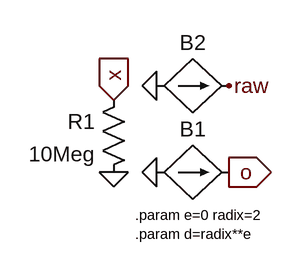
[diagram p0: schematic adc_bit_extract.asc]
adc_bit_extract.asc, the LTspice schematic file:
Version 4
SHEET 1 880 680
FLAG 256 208 o
IOPIN 256 208 Out
FLAG 176 208 0
FLAG 128 208 0
FLAG 128 128 x
IOPIN 128 128 In
FLAG 256 112 raw
FLAG 176 112 0
SYMBOL bi 176 208 R270
WINDOW 0 32 40 VTop 2
WINDOW 3 -32 65 Invisible 2
SYMATTR InstName B1
SYMATTR Value I=V(raw)-int(V(raw)/radix)*radix
SYMATTR Value2 Rpar=1
SYMBOL res 144 112 M0
SYMATTR InstName R1
SYMATTR Value 10Meg
SYMBOL bi 176 112 R270
WINDOW 0 32 40 VTop 2
WINDOW 3 -32 65 Invisible 2
SYMATTR InstName B2
SYMATTR Value I=int(V(x)/d)
SYMATTR Value2 Rpar=1
TEXT 152 256 Left 1 !.param e=0 radix=2\n.param d=radix**e

The netlist it stands for:
* adc_bit_extract.asc
B1 0 o I=V(raw)-int(V(raw)/radix)*radix Rpar=1
R1 x 0 10Meg
B2 0 raw I=int(V(x)/d) Rpar=1
.param e=0 radix=2
.param d=radix**e
.backanno
.end